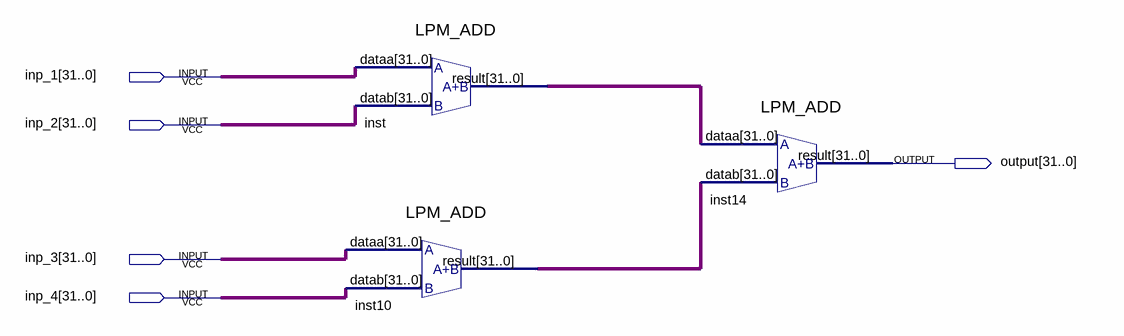
[diagram p0: schematic sheet]
// Quartus schematic adder_4_4.bdf as structural Verilog: 3 symbols, 5 pins
module adder_4_4 (
  input  [31:0] inp_1,
  input  [31:0] inp_2,
  input  [31:0] inp_3,
  input  [31:0] inp_4,
  output [31:0] \output 
);

  wire [31:0] inst10_result, inst_result;

  LPM_ADD inst (.dataa(inp_1), .datab(inp_2), .result(inst_result));
  LPM_ADD inst10 (.dataa(inp_3), .datab(inp_4), .result(inst10_result));
  LPM_ADD inst14 (.dataa(inst_result), .datab(inst10_result), .result(\output ));
endmodule
